# EAGLE schematic BtSolarMonitor (EAGLE 7.5.0)
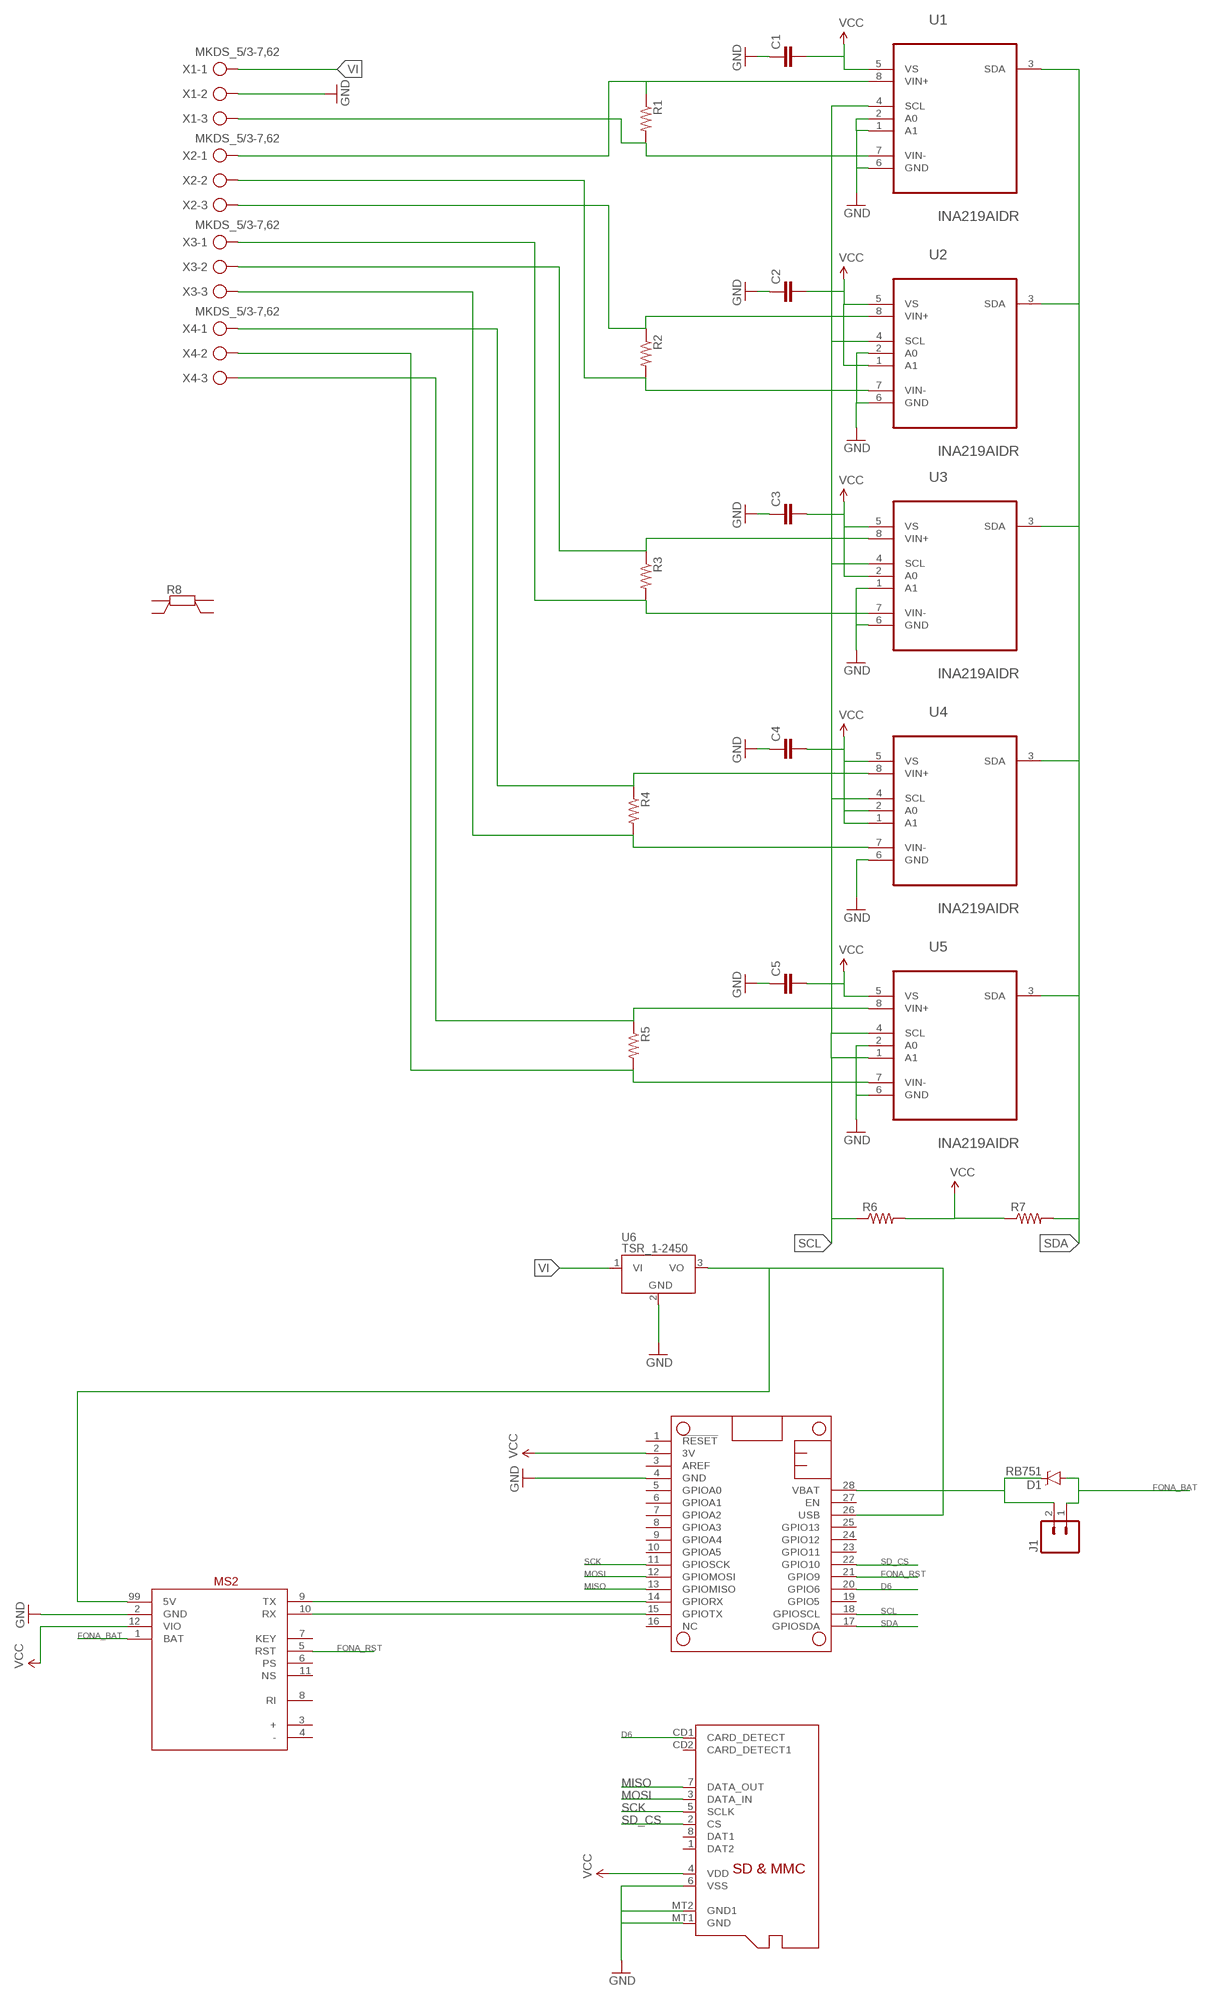
[diagram p0: schematic, sheet 1]

## Parts
C1  CAP0805  [0805]
C2  CAP0805  [0805]
C3  CAP0805  [0805]
C4  CAP0805  [0805]
C5  CAP0805  [0805]
D1  RB751  DIODE-SCHOTTKY-RB751  [SOD-523]
J1  M02PTH  [1X02]
MS1  FEATHERWING  [FEATHERWING]
MS2  FONA  [FONA]
R1  R-US_R2512  [R2512]
R2  R-US_R2512  [R2512]
R3  R-US_R2512  [R2512]
R4  R-US_R2512  [R2512]
R5  R-US_R2512  [R2512]
R6  RESISTOR0805-RES  [0805]
R7  RESISTOR0805-RES  [0805]
R8  SMV  [SMV]
U1  INA219AIDR  [SOIC127P600X175-8N]
U2  INA219AIDR  [SOIC127P600X175-8N]
U3  INA219AIDR  [SOIC127P600X175-8N]
U4  INA219AIDR  [SOIC127P600X175-8N]
U5  INA219AIDR  [SOIC127P600X175-8N]
U6  TSR_1-2450  [TSR-1]
U$1  MICROSD  [MICROSD]
X1  MKDS_5/3-7,62  [MKDS_5/3-762]
X2  MKDS_5/3-7,62  [MKDS_5/3-762]
X3  MKDS_5/3-7,62  [MKDS_5/3-762]
X4  MKDS_5/3-7,62  [MKDS_5/3-762]

## Nets
1VIN+: R1.1 U1.8(VIN+) X2.1
1VIN-: R1.2 U1.7(VIN-) X1.3
5V: MS1.26(USB) MS2.99(5V) U6.3(VO)
D6: MS1.20(GPIO6) U$1.CD1(CARD_DETECT)
FONA_BAT: D1.A J1.1 MS2.1(BAT)
FONA_RST: MS1.21(GPIO9) MS2.5(RST)
GND: C1.1 C2.1 C3.1 C4.1 C5.1 MS1.4(GND) MS2.2(GND) U1.1(A1) U1.2(A0) U1.6(GND) U2.2(A0) U2.6(GND) U3.1(A1) U3.6(GND) U4.6(GND) U5.2(A0) U5.6(GND) U6.2(GND) U$1.6(VSS) U$1.MT1(GND) U$1.MT2(GND1) X1.2
MISO: MS1.13(GPIOMISO) U$1.7(DATA_OUT)
MOSI: MS1.12(GPIOMOSI) U$1.3(DATA_IN)
N$1: R2.2 U2.7(VIN-) X2.2
N$2: MS1.15(GPIOTX) MS2.10(RX)
N$3: MS1.14(GPIORX) MS2.9(TX)
N$4: R2.1 U2.8(VIN+) X2.3
N$5: R3.1 U3.8(VIN+) X3.2
N$6: R3.2 U3.7(VIN-) X3.1
N$7: R4.2 U4.7(VIN-) X3.3
N$8: R4.1 U4.8(VIN+) X4.1
N$9: R5.1 U5.8(VIN+) X4.3
N$10: R5.2 U5.7(VIN-) X4.2
SCK: MS1.11(GPIOSCK) U$1.5(SCLK)
SCL: MS1.18(GPIOSCL) R6.1 U1.4(SCL) U2.4(SCL) U3.4(SCL) U4.4(SCL) U5.1(A1) U5.4(SCL)
SD_CS: MS1.22(GPIO10) U$1.2(CS)
SDA: MS1.17(GPIOSDA) R7.2 U1.3(SDA) U2.3(SDA) U3.3(SDA) U4.3(SDA) U5.3(SDA)
VBAT: D1.C J1.2 MS1.28(VBAT)
VCC: C1.2 C2.2 C3.2 C4.2 C5.2 MS1.2(3V) MS2.12(VIO) R6.2 R7.1 U1.5(VS) U2.1(A1) U2.5(VS) U3.2(A0) U3.5(VS) U4.1(A1) U4.2(A0) U4.5(VS) U5.5(VS) U$1.4(VDD)
VI: U6.1(VI) X1.1
Unconnected: MS1.1(!RESET) MS1.3(AREF) MS1.5(GPIOA0) MS1.6(GPIOA1) MS1.7(GPIOA2) MS1.8(GPIOA3) MS1.9(GPIOA4) MS1.10(GPIOA5) MS1.16(NC) MS1.19(GPIO5) MS1.23(GPIO11) MS1.24(GPIO12) MS1.25(GPIO13) MS1.27(EN) MS2.3(+) MS2.4(-) MS2.6(PS) MS2.7(KEY) MS2.8(RI) MS2.11(NS) R8.I1(A) R8.I2(B) R8.U1(SA) R8.U2(SB) U$1.1(DAT2) U$1.8(DAT1) U$1.CD2(CARD_DETECT1)

## Library data of the parts
C1-C5 = SparkFun-Capacitors:CAP: Capacitor Standard 0603 ceramic capacitor, and 0.1" leaded capacitor.
D1 = SparkFun-DiscreteSemi:DIODE-SCHOTTKY: Schottky diodes in SFE's production catalog BAT20J 1A 23V 0.62Vf RB751 120mA 40V 0.37Vf PMEG4005EJ 0.5A 40V 0.42Vf MBRA140 1A 40V 0.5Vf B340A 3A 40V SMA; PROD_ID: DIO-11018
J1 = SparkFun-Connectors:M02: Standard 2-pin 0.1" header. Use with - straight break away headers ( PRT-00116) - right angle break away headers (PRT-00553) - swiss pins (PRT-00743) - machine pins (PRT-00117) - female headers (PRT-00115) Molex polarized connector foot print use with: PRT-08233 with associated crimp pins and housings. 2.54_SCREWTERM for use with PRT-10571. 3.5mm Screw Terminal footprints for PRT-08084 5mm Screw Terminal footprints for use with PRT-08432
MS1 = adafruit:FEATHERWING
MS2 = BtParts:FONA
R1-R5 = adafruit:R-US_: RESISTOR, American symbol
R6 R7 = SparkFun-Resistors:RESISTOR: Resistor Basic schematic elements and footprints for 0603, 1206, and PTH resistors.
R8 = resistor-shunt:SMV: SMD SHUNT RESISTOR; OC_FARNELL: unknown; OC_NEWARK: unknown
U1-U5 = Texas Instruments_By_element14_Batch_1:INA219AIDR: CURRENT/POWER MONITOR; MPN: INA219AIDR; OC_FARNELL: -; OC_NEWARK: 45P7636; PACKAGE: SOIC-8; SUPPLIER: TEXAS INSTRUMENTS
U6 = _traco_tsr-1:TSR_1-*: TRACO TSR-1 Series Point-of-Load DC/DC-Converters Vi max. 36 V; Vo = (1.2 .. 15)V ±2%; Io = 0 .. 1 A SIP-Package (drop-in replacement for 78xx linear voltage regulators in TO220-package, vertically assembled) Source: www.tracopower.com Technologies: TSR 1- Vi (V) Vo (V) ±2% Io = 0 .. 1 A 24_ ( generic ) 2412 4.6 .. 36 1.2 2415 4.6 .. 36 1.5 2418 4.6 .. 36 1.8 2425 4.6 .. 36 2.5 2433 4.75.. 36 3.3 2450 6.5 .. 36 5.0 2465 9.0 .. 36 6.5 2490 12 .. 36 9.0 24120 15 .. 36 12 24150 18 .. 36 15 Author: Dipl.-Ing. FH Rainer Bayer HHN Hochschule Heilbronn, rainer.bayer@hs-heilbronn.de Ingenieurbüro ing-rb, mail@ing-rb.de
U$1 = adafruit:MICROSD: Micro-SD / Transflash card holder with SPI pinout For the 3M # 2908-05WB-MG and/or 4UCON #19656 push-push type
X1-X4 = con-phoenix-mkds_5:MKDS_5/3-: MKDS 5/3-6,35 Source: PHOENIX CONTACT; OC_FARNELL: unknown; OC_NEWARK: unknown